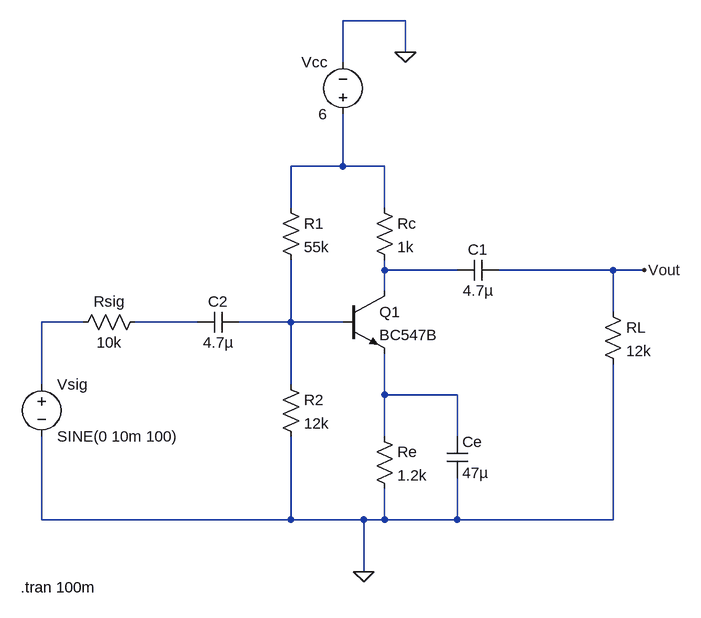
[diagram p0: schematic amplifier.asc]
amplifier.asc, the LTspice schematic file:
Version 4
SHEET 1 1112 680
WIRE 672 -352 576 -352
WIRE 672 -304 672 -352
WIRE 576 -288 576 -352
WIRE 576 -128 576 -208
WIRE 576 -128 496 -128
WIRE 640 -128 576 -128
WIRE 496 -64 496 -128
WIRE 640 -64 640 -128
WIRE 640 32 640 16
WIRE 752 32 640 32
WIRE 992 32 816 32
WIRE 1040 32 992 32
WIRE 640 64 640 32
WIRE 992 96 992 32
WIRE 176 112 112 112
WIRE 352 112 256 112
WIRE 496 112 496 16
WIRE 496 112 416 112
WIRE 576 112 496 112
WIRE 112 208 112 112
WIRE 496 208 496 112
WIRE 640 224 640 160
WIRE 752 224 640 224
WIRE 640 288 640 224
WIRE 752 288 752 224
WIRE 112 416 112 288
WIRE 496 416 496 288
WIRE 496 416 112 416
WIRE 608 416 496 416
WIRE 640 416 640 368
WIRE 640 416 608 416
WIRE 752 416 752 352
WIRE 752 416 640 416
WIRE 992 416 992 176
WIRE 992 416 752 416
WIRE 608 496 608 416
FLAG 672 -304 0
FLAG 1040 32 Vout
FLAG 608 496 0
SYMBOL res 272 96 R90
WINDOW 0 0 56 VBottom 2
WINDOW 3 32 56 VTop 2
SYMATTR InstName Rsig
SYMATTR Value 10k
SYMBOL cap 416 96 R90
WINDOW 0 0 32 VBottom 2
WINDOW 3 32 32 VTop 2
SYMATTR InstName C2
SYMATTR Value 4.7µ
SYMBOL res 480 -80 R0
SYMATTR InstName R1
SYMATTR Value 55k
SYMBOL res 624 -80 R0
SYMATTR InstName Rc
SYMATTR Value 1k
SYMBOL voltage 576 -192 R180
WINDOW 0 24 96 Left 2
WINDOW 3 24 16 Left 2
WINDOW 123 0 0 Left 0
WINDOW 39 0 0 Left 0
SYMATTR InstName Vcc
SYMATTR Value 6
SYMBOL cap 816 16 R90
WINDOW 0 0 32 VBottom 2
WINDOW 3 32 32 VTop 2
SYMATTR InstName C1
SYMATTR Value 4.7µ
SYMBOL res 976 80 R0
SYMATTR InstName RL
SYMATTR Value 12k
SYMBOL voltage 112 192 R0
WINDOW 123 0 0 Left 0
WINDOW 39 0 0 Left 0
SYMATTR InstName Vsig
SYMATTR Value SINE(0 10m 100)
SYMBOL res 480 192 R0
SYMATTR InstName R2
SYMATTR Value 12k
SYMBOL cap 736 288 R0
SYMATTR InstName Ce
SYMATTR Value 47µ
SYMBOL res 624 272 R0
SYMATTR InstName Re
SYMATTR Value 1.2k
SYMBOL npn 576 64 R0
SYMATTR InstName Q1
SYMATTR Value BC547B
TEXT 80 520 Left 2 !.tran 100m

The netlist it stands for:
* amplifier.asc
Rsig N004 N003 10k
C2 N005 N004 4.7µ
R1 N001 N005 55k
Rc N001 N002 1k
Vcc N001 0 6
C1 Vout N002 4.7µ
RL Vout 0 12k
Vsig N003 0 SINE(0 10m 100)
R2 N005 0 12k
Ce N006 0 47µ
Re N006 0 1.2k
Q1 N002 N005 N006 0 BC547B
.model NPN NPN
.model PNP PNP
.lib standard.bjt
.tran 100m
.backanno
.end